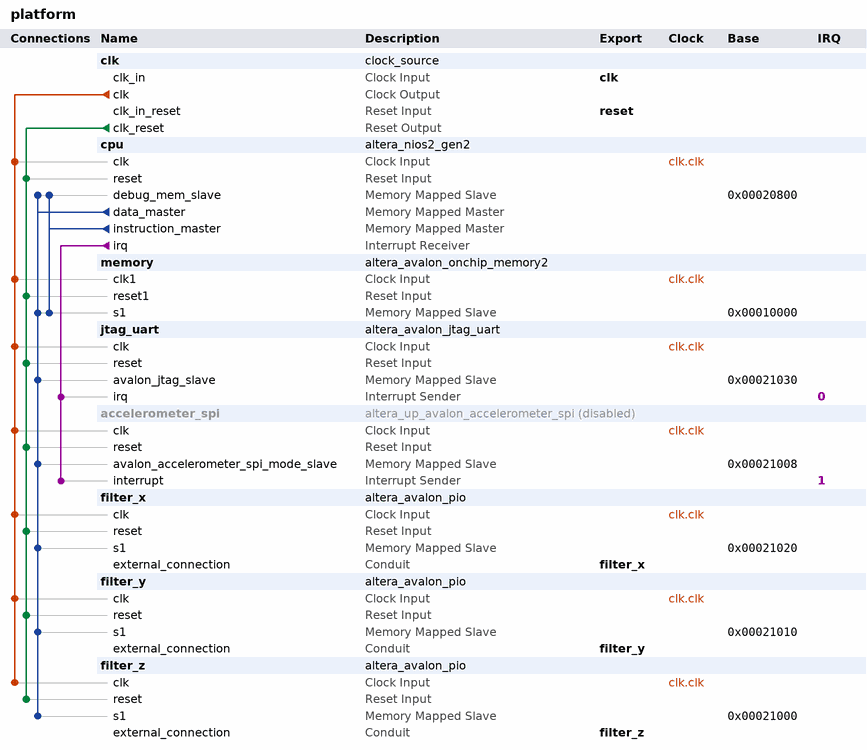
[diagram p0: system contents]
# Platform Designer (Qsys) system platform, MAX 10 10M50DAF484C7G
# Parameters at their usual value, and those the tool derives, are not listed.
package require -exact qsys 18.1
create_system platform
set_project_property DEVICE_FAMILY {MAX 10}
set_project_property DEVICE 10M50DAF484C7G

add_instance clk clock_source 18.1
set_instance_parameter_value clk clockFrequency 50000000

add_instance cpu altera_nios2_gen2 18.1
set_instance_parameter_value cpu dcache_size 2048
set_instance_parameter_value cpu exceptionSlave memory.s1
set_instance_parameter_value cpu icache_size 4096
set_instance_parameter_value cpu impl Tiny
set_instance_parameter_value cpu resetSlave memory.s1

add_instance memory altera_avalon_onchip_memory2 18.1
set_instance_parameter_value memory dataWidth 32
set_instance_parameter_value memory dualPort false
set_instance_parameter_value memory initMemContent false
set_instance_parameter_value memory initializationFileName onchip_mem.hex
set_instance_parameter_value memory memorySize 65536

add_instance jtag_uart altera_avalon_jtag_uart 18.1
set_instance_parameter_value jtag_uart simInteractiveOptions NO_INTERACTIVE_WINDOWS

add_instance accelerometer_spi altera_up_avalon_accelerometer_spi 18.0
set_instance_property accelerometer_spi ENABLED false

add_instance filter_x altera_avalon_pio 18.1
set_instance_parameter_value filter_x direction Input
set_instance_parameter_value filter_x width 16

add_instance filter_y altera_avalon_pio 18.1
set_instance_parameter_value filter_y direction Input
set_instance_parameter_value filter_y width 16

add_instance filter_z altera_avalon_pio 18.1
set_instance_parameter_value filter_z direction Input
set_instance_parameter_value filter_z width 16

# connections
add_connection clk.clk accelerometer_spi.clk clock
add_connection clk.clk cpu.clk clock
add_connection clk.clk filter_x.clk clock
add_connection clk.clk filter_y.clk clock
add_connection clk.clk filter_z.clk clock
add_connection clk.clk jtag_uart.clk clock
add_connection clk.clk memory.clk1 clock
add_connection clk.clk_reset accelerometer_spi.reset reset
add_connection clk.clk_reset cpu.reset reset
add_connection clk.clk_reset filter_x.reset reset
add_connection clk.clk_reset filter_y.reset reset
add_connection clk.clk_reset filter_z.reset reset
add_connection clk.clk_reset jtag_uart.reset reset
add_connection clk.clk_reset memory.reset1 reset
add_connection cpu.data_master accelerometer_spi.avalon_accelerometer_spi_mode_slave avalon
set_connection_parameter_value cpu.data_master/accelerometer_spi.avalon_accelerometer_spi_mode_slave baseAddress 0x00021008
add_connection cpu.data_master cpu.debug_mem_slave avalon
set_connection_parameter_value cpu.data_master/cpu.debug_mem_slave baseAddress 0x00020800
add_connection cpu.data_master filter_x.s1 avalon
set_connection_parameter_value cpu.data_master/filter_x.s1 baseAddress 0x00021020
add_connection cpu.data_master filter_y.s1 avalon
set_connection_parameter_value cpu.data_master/filter_y.s1 baseAddress 0x00021010
add_connection cpu.data_master filter_z.s1 avalon
set_connection_parameter_value cpu.data_master/filter_z.s1 baseAddress 0x00021000
add_connection cpu.data_master jtag_uart.avalon_jtag_slave avalon
set_connection_parameter_value cpu.data_master/jtag_uart.avalon_jtag_slave baseAddress 0x00021030
add_connection cpu.data_master memory.s1 avalon
set_connection_parameter_value cpu.data_master/memory.s1 baseAddress 0x00010000
add_connection cpu.instruction_master cpu.debug_mem_slave avalon
set_connection_parameter_value cpu.instruction_master/cpu.debug_mem_slave baseAddress 0x00020800
add_connection cpu.instruction_master memory.s1 avalon
set_connection_parameter_value cpu.instruction_master/memory.s1 baseAddress 0x00010000
add_connection cpu.irq accelerometer_spi.interrupt interrupt
set_connection_parameter_value cpu.irq/accelerometer_spi.interrupt irqNumber 1
add_connection cpu.irq jtag_uart.irq interrupt
set_connection_parameter_value cpu.irq/jtag_uart.irq irqNumber 0

# exported interfaces
add_interface clk clock sink
set_interface_property clk EXPORT_OF clk.clk_in
add_interface filter_x conduit end
set_interface_property filter_x EXPORT_OF filter_x.external_connection
add_interface filter_y conduit end
set_interface_property filter_y EXPORT_OF filter_y.external_connection
add_interface filter_z conduit end
set_interface_property filter_z EXPORT_OF filter_z.external_connection
add_interface reset reset sink
set_interface_property reset EXPORT_OF clk.clk_in_reset

set_interconnect_requirement {$system} qsys_mm.clockCrossingAdapter HANDSHAKE
set_interconnect_requirement {$system} qsys_mm.enableEccProtection FALSE
set_interconnect_requirement {$system} qsys_mm.insertDefaultSlave FALSE
set_interconnect_requirement {$system} qsys_mm.maxAdditionalLatency 1

save_system platform.qsys
